# EasyEDA schematic table1.json
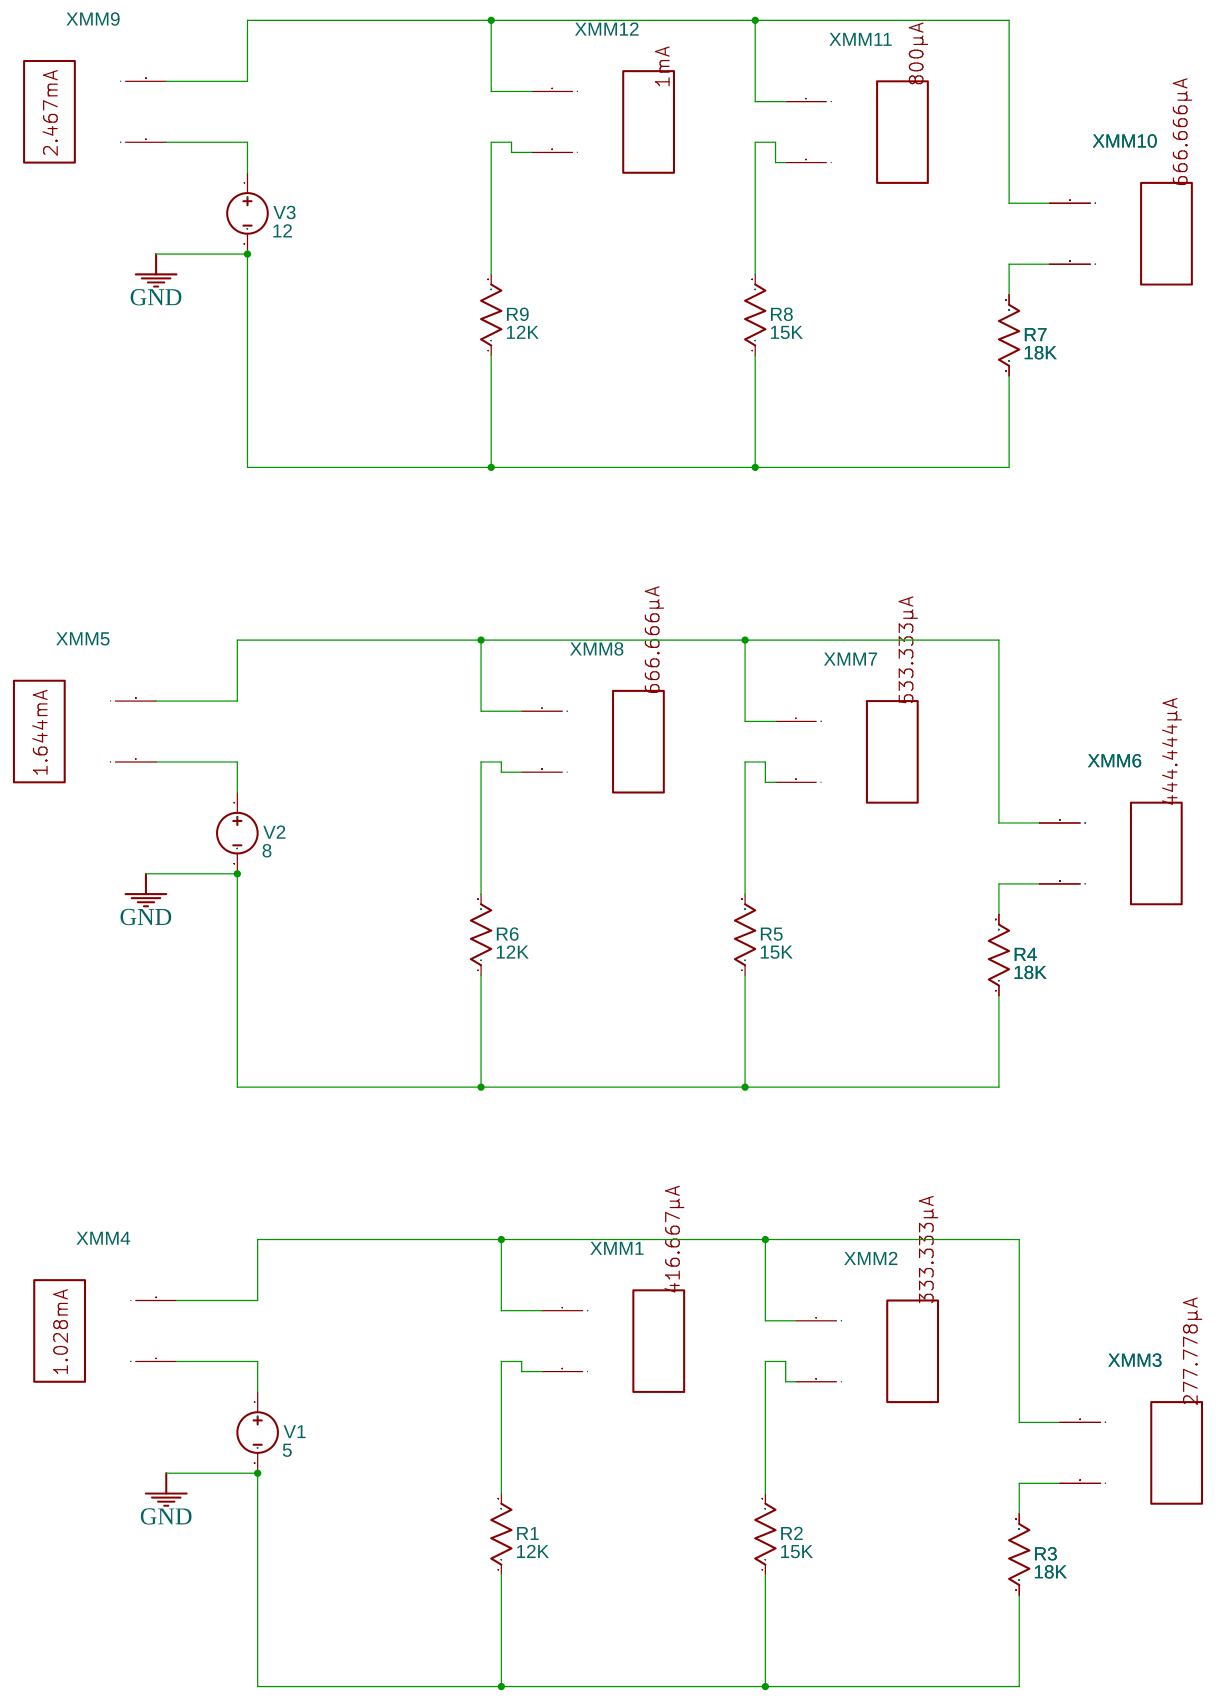
[diagram p0: schematic sheet]

## Parts
R1  12K  [AXIAL-0.3]
R2  15K  [AXIAL-0.3]
R3  18K  [AXIAL-0.3]
R4  18K  [AXIAL-0.3]
R5  15K  [AXIAL-0.3]
R6  12K  [AXIAL-0.3]
R7  18K  [AXIAL-0.3]
R8  15K  [AXIAL-0.3]
R9  12K  [AXIAL-0.3]
V1  5  [HDR1X2]
V2  8  [HDR1X2]
V3  12  [HDR1X2]
XMM1  Multimeter
XMM2  Multimeter
XMM3  Multimeter
XMM4  Multimeter
XMM5  Multimeter
XMM6  Multimeter
XMM7  Multimeter
XMM8  Multimeter
XMM9  Multimeter
XMM10  Multimeter
XMM11  Multimeter
XMM12  Multimeter

## Library data of the parts
R1-R9 = Resistor_US: Resistance: 1k; Contributor: EasyEDA; Supplier: YUJING
V1-V3 = VDC: Contributor: EasyEDA; sim: true
XMM1-XMM12 = MULTIMETER: Supplier: LCSC; Multimeter Type: Amper; Power Type: AC; Voltmeter resistance: 10μ; Ammeter resistance: 1G; NameDisplay: 0; Contributor: EasyEDA; sim: true

## Nets
GND: R1.1 R2.1 R3.1 R4.1 R5.1 R6.1 R7.1 R8.1 R9.1 V1.2 V2.2 V3.2
Net-(R1-2): R1.2 XMM1.2(I)
Net-(R2-2): R2.2 XMM2.2(I)
Net-(R3-2): R3.2 XMM3.2(I)
Net-(R4-2): R4.2 XMM6.2(I)
Net-(R5-2): R5.2 XMM7.2(I)
Net-(R6-2): R6.2 XMM8.2(I)
Net-(R7-2): R7.2 XMM10.2(I)
Net-(R8-2): R8.2 XMM11.2(I)
Net-(R9-2): R9.2 XMM12.2(I)
Net-(V1-1): V1.1 XMM4.1(+)
Net-(V2-1): V2.1 XMM5.1(+)
Net-(V3-1): V3.1 XMM9.1(+)
Net-(XMM1-1): XMM1.1(+) XMM2.1(+) XMM3.1(+) XMM4.2(I)
Net-(XMM5-2): XMM5.2(I) XMM6.1(+) XMM7.1(+) XMM8.1(+)
Net-(XMM9-2): XMM9.2(I) XMM10.1(+) XMM11.1(+) XMM12.1(+)
